# Altium schematic sheet Vibration.SchDoc: Vibration
size A4; Author: João Guimarães; Organization: Altium Limited; Address1: L3, 12a Rodborough Rd; Address2: Frenchs Forest; Address3: NSW; Address4: Australia 2086; Revision: 2.0
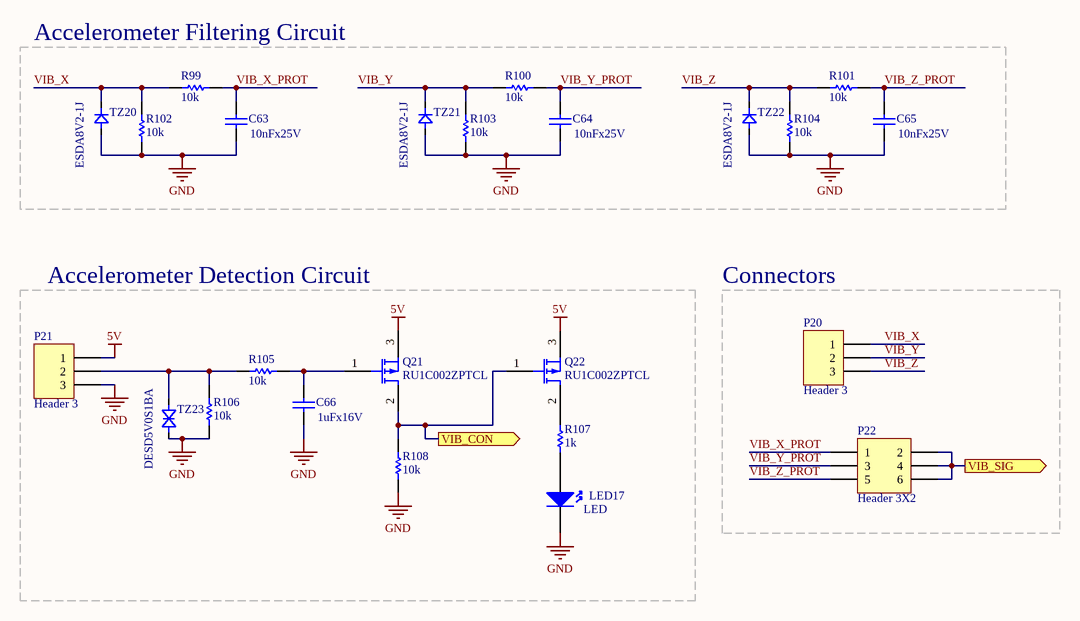
[diagram p0: Vibration.SchDoc]

## Parts
C63  10nFx25V  [DISC-0805]
C64  10nFx25V  [DISC-0805]
C65  10nFx25V  [DISC-0805]
C66  1uFx16V  [DISC-0805]
LED17  LED  [DISC-LED-0.1-PTH]
P20  Header 3  [CON-BORNE-3]
P21  Header 3  [CON-BORNE-3]
P22  Header 3X2  [CON-HEADER-2X3-PTH]
Q21  RU1C002ZPTCL  [DISC-SOT-23]
Q22  RU1C002ZPTCL  [DISC-SOT-23]
R99  10k  [DISC-0805]
R100  10k  [DISC-0805]
R101  10k  [DISC-0805]
R102  10k  [DISC-0805]
R103  10k  [DISC-0805]
R104  10k  [DISC-0805]
R105  10k  [DISC-0805]
R106  10k  [DISC-0805]
R107  1k  [DISC-0805]
R108  10k  [DISC-0805]
TZ20  ESDA8V2-1J  [DISC-SOD-323]
TZ21  ESDA8V2-1J  [DISC-SOD-323]
TZ22  ESDA8V2-1J  [DISC-SOD-323]
TZ23  DESD5V0S1BA  [DISC-SOD-323]

## Blocks framed on the sheet
Accelerometer Filtering Circuit: C63-C65 R99-R104 TZ20-TZ22
Accelerometer Detection Circuit: C66 LED17 P21 Q21 Q22 R105-R108 TZ23
Connectors: P20 P22

## Ports
VIB_CON (out), VIB_SIG (out)

## Nets
5V: P21.1 Q21.3(S) Q22.3(S)
GND: C63.1 C64.1 C65.1 C66.1 LED17.2(K) P21.3 R102.2 R103.2 R104.2 R106.2 R108.1 TZ20.1(A) TZ21.1(A) TZ22.1(A) TZ23.1(A)
VIB_CON: Q21.2(D) Q22.1(G) R108.2 ; port VIB_CON
VIB_SIG: P22.2 P22.4 P22.6 ; port VIB_SIG
VIB_X: P20.1 R99.2 R102.1 TZ20.2(C)
VIB_X_PROT: C63.2 P22.1 R99.1
VIB_Y: P20.2 R100.2 R103.1 TZ21.2(C)
VIB_Y_PROT: C64.2 P22.3 R100.1
VIB_Z: P20.3 R101.2 R104.1 TZ22.2(C)
VIB_Z_PROT: C65.2 P22.5 R101.1
NetC66_2: C66.2 Q21.1(G) R105.2
NetLED17_1: LED17.1(A) R107.1
NetP21_2: P21.2 R105.1 R106.1 TZ23.2(K)
NetQ22_2: Q22.2(D) R107.2

## Notes on the sheet
- Title:
- Project:
- Date:
- Author:
- Version:
- File:

## Library data of the parts
C63-C66 = Cap: Capacitor
P20 P21 = Header 3: Header, 3-Pin; LatestRevisionDate: 17-Jul-2002; LatestRevisionNote: Re-released for DXP Platform.; Publisher: Altium Limited
P22 = Header 3X2: Header, 3-Pin, Dual row; LatestRevisionDate: 17-Jul-2002; LatestRevisionNote: Re-released for DXP Platform.; Publisher: Altium Limited
Q21 Q22 = Transistor-PMOS: P-Channel MOSFET
R99-R108 = Res: Resistor
TZ20-TZ22 = TVZ-Unidirectional
TZ23 = TVZ-Bi-Directional